# EAGLE design G879 (EAGLE 6.6.0)
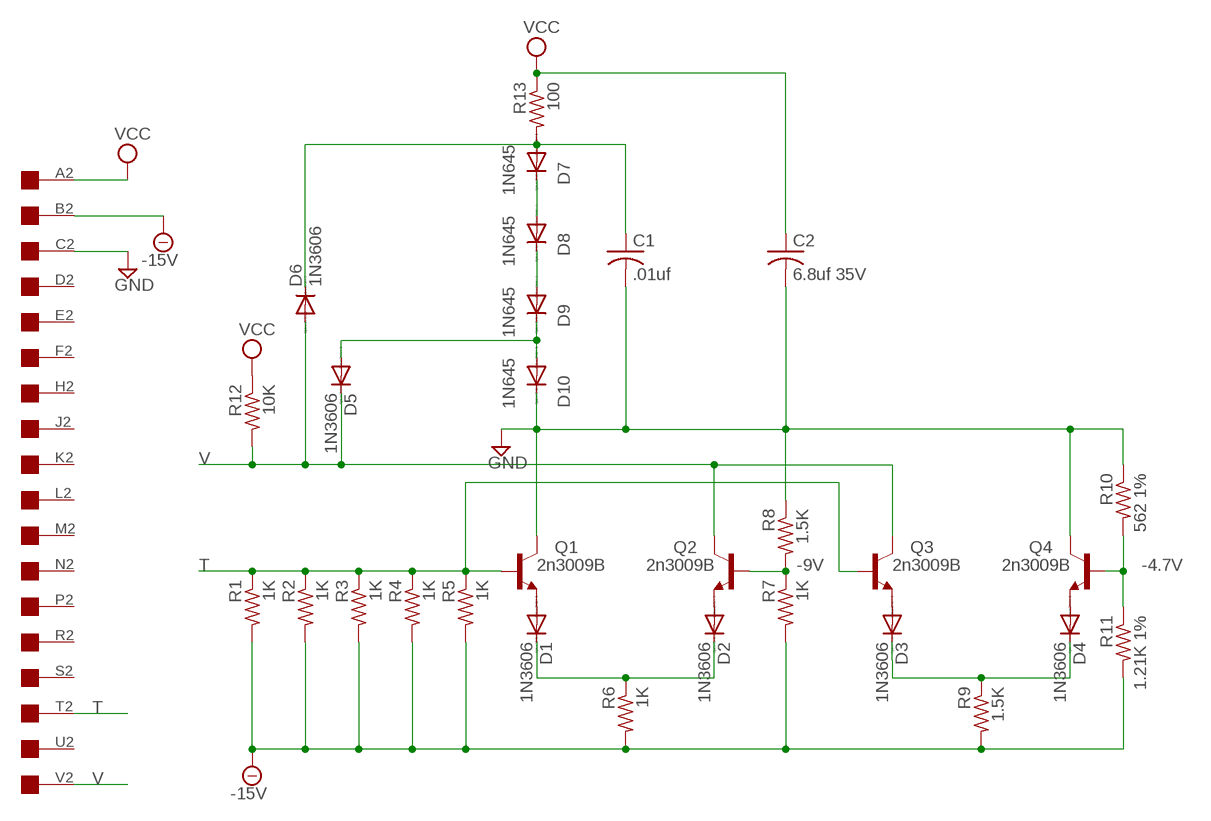
[diagram p0: schematic, sheet 1]

## Parts
C1  .01uf  C-US050-025X075  [C050-025X075]
C2  6.8uf 35V  C-US102-054X133  [C102-054X133]
D1  1N3606  1N4004  [DO41-10]
D2  1N3606  1N4004  [DO41-10]
D3  1N3606  1N4004  [DO41-10]
D4  1N3606  1N4004  [DO41-10]
D5  1N3606  1N4004  [DO41-10]
D6  1N3606  1N4004  [DO41-10]
D7  1N645  1N4004  [DO41-10]
D8  1N645  1N4004  [DO41-10]
D9  1N645  1N4004  [DO41-10]
D10  1N645  1N4004  [DO41-10]
Q1  2n3009B  2N1711  [TO39]
Q2  2n3009B  2N1711  [TO39]
Q3  2n3009B  2N1711  [TO39]
Q4  2n3009B  2N1711  [TO39]
R1  1K  R-US_0207/10  [0207/10]
R2  1K  R-US_0207/10  [0207/10]
R3  1K  R-US_0207/10  [0207/10]
R4  1K  R-US_0207/10  [0207/10]
R5  1K  R-US_0207/10  [0207/10]
R6  1K  R-US_0207/10  [0207/10]
R7  1K  R-US_0207/10  [0207/10]
R8  1.5K  R-US_0207/10  [0207/10]
R9  1.5K  R-US_0207/10  [0207/10]
R10  562 1%  R-US_0207/10  [0207/10]
R11  1.21K 1%  R-US_0207/10  [0207/10]
R12  10K  R-US_0207/10  [0207/10]
R13  100  R-US_0207/10  [0207/10]
U$5  ONE-SIDED  [ONE-SIDED]

## Nets
-4.7V: Q4.2(B) R10.2 R11.1
-9V: Q2.2(B) R7.1 R8.2
-15V: R1.2 R2.2 R3.2 R4.2 R5.2 R6.2 R7.2 R9.2 R11.2 U$5.B2
GND: C1.2 C2.2 D10.C Q1.3(C) Q4.3(C) R8.1 R10.1 U$5.C2
N$1: D1.A Q1.1(E)
N$2: D3.C D4.C R9.1
N$3: D2.A Q2.1(E)
N$4: D4.A Q4.1(E)
N$5: D5.A D9.C D10.A
N$6: D1.C D2.C R6.1
N$7: D8.C D9.A
N$8: D3.A Q3.1(E)
N$9: D7.C D8.A
N$10: C1.1 D6.C D7.A R13.2
T: Q1.2(B) Q3.2(B) R1.1 R2.1 R3.1 R4.1 R5.1 U$5.T2
V: D5.C D6.A Q2.3(C) Q3.3(C) R12.2 U$5.V2
VCC: C2.1 R12.1 R13.1 U$5.A2
Unconnected: U$5.D2 U$5.E2 U$5.F2 U$5.H2 U$5.J2 U$5.K2 U$5.L2 U$5.M2 U$5.N2 U$5.P2 U$5.R2 U$5.S2 U$5.U2

## Library data of the parts
C1 C2 = rcl:C-US: CAPACITOR, American symbol
D1-D10 = diode:1N4004: DIODE general purpose rectifier, 1 A
Q1-Q4 = transistor-npn:2N1711: NPN Transistor
R1-R13 = rcl:R-US_: RESISTOR, American symbol
U$5 = con-dec:ONE-SIDED: One-sided DEC Flip-Chip single card fingers

## Board
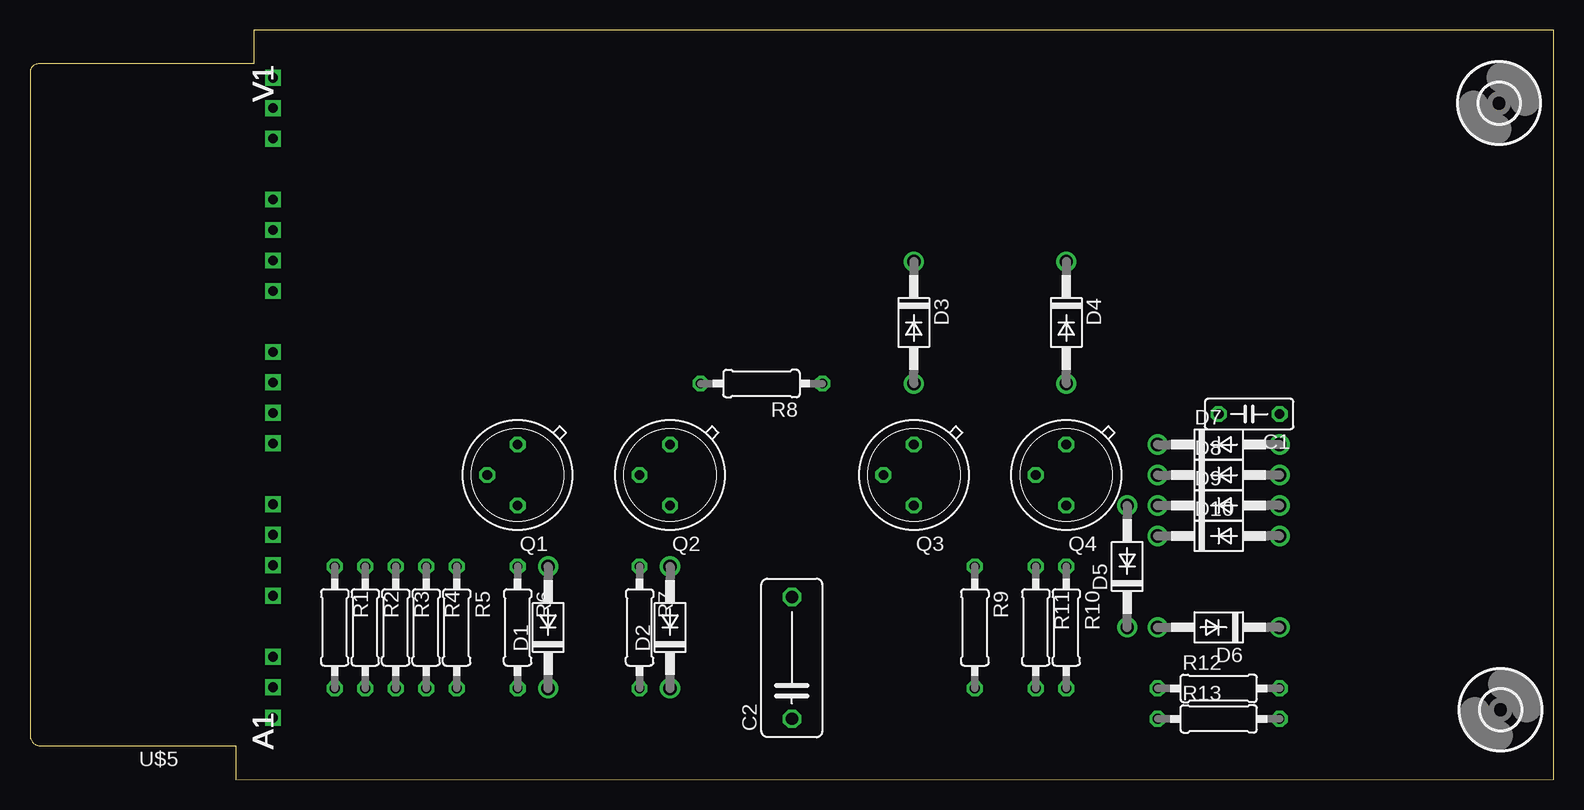
[diagram p1: board, top side]
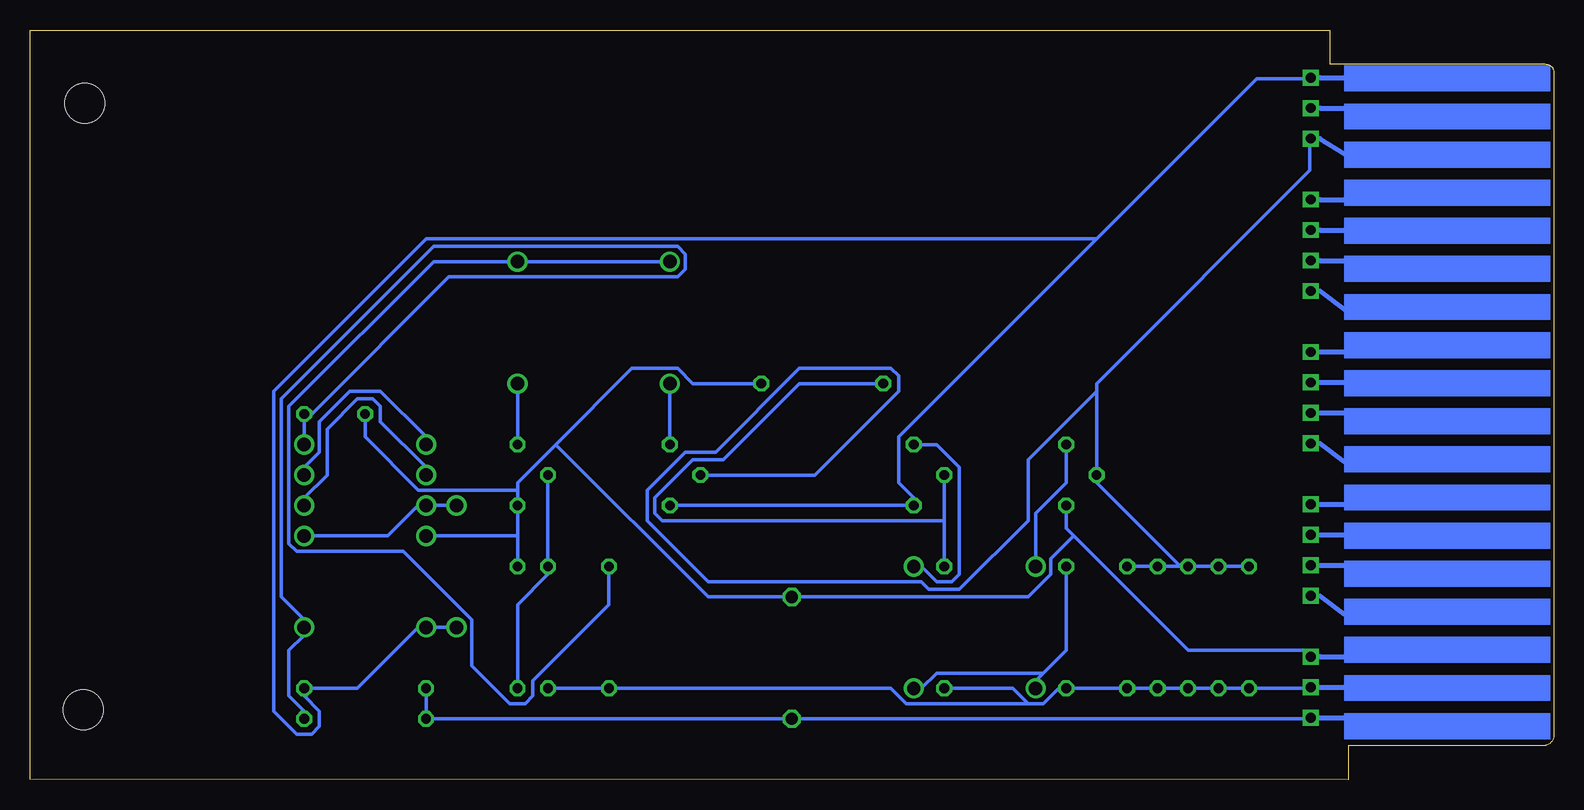
[diagram p2: board, bottom side, seen from below]

Size 126.98 x 62.48 mm. Coordinates in mm from the lower left corner, seen from the top.
Outline: 17.14,2.83 17.14,0 126.98,0.04 126.98,62.45 18.66,62.48 18.66,59.65 0.69,59.65 arc90 0,58.96 0,3.72 arc90 0.89,2.83 17.14,2.83
Copper layers (1*16): Top 0.035mm / dielectric 1.5mm / Bottom 0.035mm
Design rules "10mils": minimum track width 12mil, minimum drill 28mil, track to track 10mil, track to pad 10mil, pad to pad 10mil, via to via 10mil, smd to smd 10mil, copper to edge 40mil, drill to drill 10mil, minimum pad ring 10mil, minimum via ring 8mil, stop-mask expansion 0mil, vias tented up to drill 0mil, thermal gap 10mil

### Footprints (pad centres in the part's own frame; a part is rotated, then mirrored left to right if it is on the bottom)
C050-025X075 = drill 0.813 octagon: 1 -2.54,0; 2 2.54,0
C102-054X133 = drill 1.016 octagon: 1 -5.08,0; 2 5.08,0
DO41-10 = drill 1.118: A 5.08,0; C -5.08,0
TO39 = drill 0.813 octagon: 1 0,-2.54; 2 2.54,0; 3 0,2.54
0207/10 = drill 0.813 octagon: 1 -5.08,0; 2 5.08,0
3,3 = hole 3.3: 0,0
ONE-SIDED = drill 0.813 square: A2 20.256,5.175; B2 20.256,7.715; C2 20.256,10.255; D2 20.256,15.335; E2 20.256,17.875; F2 20.256,20.415; H2 20.256,22.955; J2 20.256,28.035; K2 20.256,30.575; L2 20.256,33.115; M2 20.256,35.655; N2 20.256,40.735; P2 20.256,43.275; R2 20.256,45.815; S2 20.256,48.355; T2 20.256,53.435; U2 20.256,55.975; V2 20.256,58.515

### Placement (x,y rotation side)
C1  101.59,30.48 180 top
C2  63.49,10.16 90 top
D1  43.17,12.7 90 top
D2  53.34,12.7 90 top
D3  73.66,38.1 270 top
D4  86.36,38.1 270 top
D5  91.44,17.78 90 top
D6  99.06,12.7 180 top
D7  99.06,27.94 0 top
D8  99.06,25.4 0 top
D9  99.06,22.86 0 top
D10  99.06,20.32 0 top
Q1  40.63,25.4 180 top
Q2  53.34,25.4 180 top
Q3  73.66,25.4 180 top
Q4  86.36,25.4 180 top
R1  25.39,12.7 270 top
R2  27.94,12.7 270 top
R3  30.48,12.7 270 top
R4  33.02,12.7 270 top
R5  35.55,12.7 270 top
R6  40.63,12.7 270 top
R7  50.79,12.7 270 top
R8  60.95,33.02 180 top
R9  78.73,12.7 270 top
R10  86.36,12.7 270 top
R11  83.81,12.7 270 top
R12  99.06,7.62 0 top
R13  99.06,5.08 0 top
U$2  [3,3]  122.42,56.39 0 top
U$3  [3,3]  122.55,5.84 0 top
U$5  -0.01,0 0 top

### Tracks (layer width: path | path; a pad name or v marks a point on that pad's centre or on a via)
-4.7V
  Bottom 0.305: Q4.2 83.81,24.77 83.81,18.41 R11.1 83.81,17.14 86.36,14.61 86.36,8.26 R10.2
-9V
  Bottom 0.305: 50.79,21.59 50.79,24.77 Q2.2 | 50.79,21.59 50.79,18.41 R7.1 | 50.79,21.59 74.29,21.59 74.93,22.23 74.93,23.5 71.75,26.67 69.21,26.67 62.86,33.02 56.51,33.02 R8.2
-15V
  Bottom 0.305: R11.2 83.18,7.62 79.37,7.62 R9.2 78.1,7.62 55.24,7.62 53.97,6.35 43.81,6.35 | U$5.B2 20.32,7.62 24.76,7.62 R1.2 26.03,7.62 27.3,7.62 R2.2 28.57,7.62 29.84,7.62 R3.2 31.11,7.62 32.38,7.62 R4.2 33.65,7.62 34.92,7.62 R5.2 36.19,7.62 40,7.62 R6.2 41.27,7.62 42.54,6.35 43.81,6.35 | 43.81,6.35 45.08,7.62 50.16,7.62 R7.2
GND
  Bottom 0.305: 40,20.32 40.63,20.95 40.63,22.23 Q1.3 | 40,20.32 30.48,10.79 20.32,10.79 U$5.C2 | 86.36,20.32 86.36,22.23 Q4.3 86.36,23.5 86.36,24.13 | 86.36,20.32 86.36,18.41 R10.1 | 83.18,27.94 86.36,24.77 86.36,24.13 | 83.18,27.94 76.83,34.29 73.02,34.29 71.75,33.02 66.67,33.02 R8.1 | 86.36,24.13 94.61,24.13 99.06,28.57 99.06,29.84 C1.2 | 83.18,27.94 70.48,15.24 64.13,15.24 C2.2 62.86,15.24 43.81,15.24 41.9,17.14 41.9,18.41 40,20.32 | 86.36,20.32 93.34,20.32 D10.C
N$1
  Bottom 0.305: Q1.1 40.63,27.3 40.63,24.77 43.17,22.23 43.17,18.41 D1.A
N$2
  Bottom 0.305: R9.1 78.73,17.14 78.73,14.61 85.09,8.26 85.09,6.99 85.72,6.35 86.99,6.35 90.17,9.53 90.17,13.34 95.88,19.05 104.77,19.05 105.41,19.68 105.41,31.11 93.34,43.18 86.99,43.18 D4.C 85.72,43.18 74.29,43.18 D3.C
N$3
  Bottom 0.305: Q2.1 52.7,27.94 51.43,27.94 49.52,26.04 49.52,17.14 50.16,16.51 51.43,16.51 52.7,17.78 D2.A
N$4
  Bottom 0.305: Q4.1 86.36,28.57 86.36,32.38 D4.A
N$5
  Bottom 0.305: D5.A 92.07,22.86 93.34,22.86 D9.C 94.61,22.86 97.15,20.32 103.5,20.32 D10.A
N$6
  Bottom 0.305: 42.54,8.89 43.17,8.26 D1.C | 42.54,8.89 40.63,10.79 40.63,17.14 R6.1 | 42.54,8.89 51.43,8.89 52.7,7.62 D2.C
N$7
  Bottom 0.305: D8.C 93.98,26.04 97.79,29.84 97.79,31.11 98.42,31.75 99.69,31.75 102.23,29.21 102.23,25.4 104.14,23.5 D9.A
N$8
  Bottom 0.305: Q3.1 73.66,28.57 73.66,32.38 D3.A
N$9
  Bottom 0.305: D7.C 93.98,28.57 97.79,32.38 100.33,32.38 102.87,29.84 102.87,27.3 104.14,26.04 D8.A
N$10
  Bottom 0.305: D7.A 104.14,28.57 104.14,29.84 C1.1 103.5,30.48 92.07,41.91 73.02,41.91 72.39,42.55 72.39,43.81 73.02,44.45 93.34,44.45 106.04,31.75 106.04,15.24 104.14,13.34 D6.C 104.14,12.06 105.41,10.79 105.41,6.99 104.14,5.71 R13.2
T
  Bottom 0.305: R1.1 26.03,17.78 27.3,17.78 R2.1 28.57,17.78 29.84,17.78 R3.1 | 31.11,17.78 32.38,17.78 R4.1 33.65,17.78 34.92,17.78 R5.1 | R3.1 31.11,17.78 | 31.11,17.78 38.09,24.77 Q1.2 38.09,26.04 38.09,32.38 | R3.1 31.11,17.78 | 38.09,32.38 38.09,33.02 20.32,50.8 20.32,53.34 U$5.T2 | 38.09,32.38 43.81,26.67 43.81,21.59 49.52,15.88 52.06,15.88 52.7,16.51 70.48,16.51 75.56,21.59 75.56,24.13 72.39,27.3 69.84,27.3 62.86,34.29 55.24,34.29 54.6,33.66 54.6,32.38 61.59,25.4 70.48,25.4 Q3.2
V
  Bottom 0.305: D5.C 92.07,12.7 93.34,12.7 D6.A 94.61,12.7 99.69,7.62 103.5,7.62 R12.2 104.14,6.99 102.87,5.71 102.87,4.45 103.5,3.81 104.77,3.81 106.68,5.71 106.68,32.38 93.98,45.09 38.09,45.09 | 38.09,45.09 54.6,28.57 54.6,24.77 53.34,23.5 Q2.3 53.97,22.86 73.02,22.86 Q3.3 | 38.09,45.09 24.76,58.42 20.32,58.42 U$5.V2
VCC
  Bottom 0.305: R12.1 93.98,6.99 93.98,5.71 R13.1 93.34,5.08 64.13,5.08 C2.1 62.86,5.08 20.32,5.08 U$5.A2

### Text on the board
tNames: V1 | V1 | V1 | V1 | V1 | V1 | V1 | V1 | V1 | V1 | V1 | V1 | V1 | V1 | V1 | V1 | V1 | V1 | V1 | V1 | V1 | V1 | V1 | V1 | V1 | V1 | V1 | V1 | V1 | V1 | V1 | V1 | A1 | A1 | A1 | A1 | A1 | A1 | A1 | A1 | A1 | A1 | A1 | A1 | A1 | A1 | A1 | A1 | A1 | A1 | A1 | A1 | A1 | A1 | A1 | A1 | A1 | A1 | A1 | A1 | A1 | A1 | A1 | A1